# Altium schematic sheet MCU_Supply.SchDoc
size A4
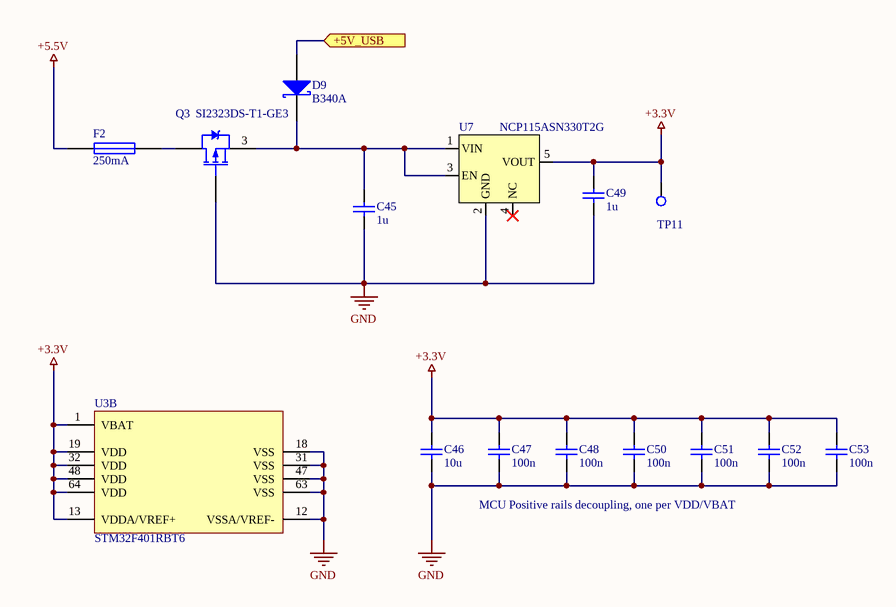
[diagram p0: MCU_Supply.SchDoc]

## Parts
C45  1u  [CAPC1608X87N]
C46  10u  [CAPC2012X110N]
C47  100n  [CAPC1608X87N]
C48  100n  [CAPC1608X87N]
C49  1u  [CAPC1608X87N]
C50  100n  [CAPC1608X87N]
C51  100n  [CAPC1608X87N]
C52  100n  [CAPC1608X87N]
C53  100n  [CAPC1608X87N]
D9  B340A  [SODFL5226X110N]
F2  250mA  [RESC1608X55N]
Q3  SI2323DS-T1-GE3  [SOT95P237X112-3N]
TP11  TP  [TEST-POINT]  (value not drawn)  (no BOM)
U3  STM32F401RBT6  [QFP50P1200X1200X160-64N]  (part B of 2)
U7  NCP115ASN330T2G  [SOT95P280X145-5N]

## Ports
+5V_USB (in)

## Nets
+3.3V: C46.2 C47.1 C48.2 C49.2 C50.2 C51.2 C52.2 C53.2 TP11.0 U3.1(VBAT) U3.13(VDDA/VREF+) U3.19(VDD) U3.32(VDD) U3.48(VDD) U3.64(VDD) U7.5(VOUT)
+5.5V: F2.1
GND: C45.1 C46.1 C47.2 C48.1 C49.1 C50.1 C51.1 C52.1 C53.1 Q3.1(G) U3.12(VSSA/VREF-) U3.18(VSS) U3.31(VSS) U3.47(VSS) U3.63(VSS) U7.2(GND)
+5V_USB: D9.1(A) ; port +5V_USB
NetC45_2: C45.2 D9.2(K) Q3.3(S) U7.1(VIN) U7.3(EN)
NetF2_2: F2.2 Q3.2(D)

Not connected (* = marked no-connect by the designer): U7 4(NC)*

## Notes on the sheet
- MCU Positive rails decoupling, one per VDD/VBAT

## Library data of the parts
C45 C49 = Cap: Manufacturer 1: Taiyo Yuden; Manufacturer Part Number 1: EMK107BJ105KA-T
C46 = Cap: Manufacturer 1: Taiyo Yuden; Manufacturer Part Number 1: EMK212BB7106KG-T
C47 C48 C50-C53 = Cap: Manufacturer 1: Taiyo Yuden; Manufacturer Part Number 1: EMK107B7104KA-T
D9 = D Schottky
F2 = Fuse 1: Manufacturer 1: Bourns; Manufacturer Part Number 1: SF-0603FP025F-2
Q3 = PMOS-2
TP11 = TEST_POINT: Generic test point
U7 = NCP115: Manufacturer 1: ON Semiconductor; Manufacturer Part Number 1: NCP115ASN330T2G